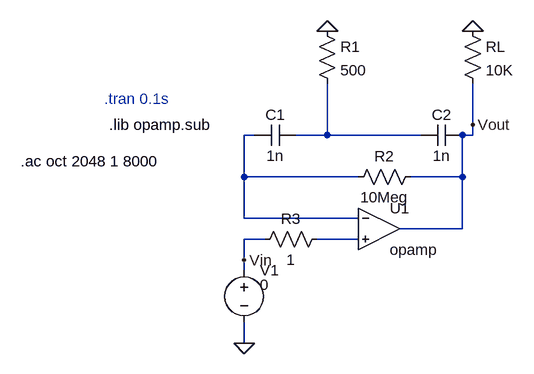
[diagram p0: schematic opamp_ideal.asc]
opamp_ideal.asc, the LTspice schematic file:
Version 4
SHEET 1 880 680
WIRE 544 272 544 208
WIRE 208 288 192 288
WIRE 320 288 320 208
WIRE 320 288 272 288
WIRE 464 288 320 288
WIRE 544 288 544 272
WIRE 544 288 528 288
WIRE 192 352 192 288
WIRE 368 352 192 352
WIRE 528 352 528 288
WIRE 528 352 448 352
WIRE 192 416 192 352
WIRE 368 416 192 416
WIRE 528 432 528 352
WIRE 528 432 432 432
WIRE 224 448 192 448
WIRE 368 448 304 448
WIRE 192 480 192 448
WIRE 192 496 192 480
WIRE 192 608 192 576
FLAG 192 608 0
FLAG 544 128 0
FLAG 320 128 0
FLAG 544 272 Vout
FLAG 192 480 Vin
SYMBOL /voltage 192 480 R0
WINDOW 3 24 38 Left 2
SYMATTR Value 0
SYMATTR InstName V1
SYMATTR Value2 AC 100m
SYMBOL /cap 528 272 R90
WINDOW 0 0 32 VBottom 2
WINDOW 3 32 32 VTop 2
SYMATTR InstName C2
SYMATTR Value 1n
SYMBOL /cap 272 272 R90
WINDOW 0 0 32 VBottom 2
WINDOW 3 32 32 VTop 2
SYMATTR InstName C1
SYMATTR Value 1n
SYMBOL /res 464 336 R90
WINDOW 0 0 56 VBottom 2
WINDOW 3 32 56 VTop 2
SYMATTR InstName R2
SYMATTR Value 10Meg
SYMBOL /res 304 112 R0
SYMATTR InstName R1
SYMATTR Value 500
SYMBOL /res 528 112 R0
SYMATTR InstName RL
SYMATTR Value 10K
SYMBOL opamp 400 368 R0
SYMATTR InstName U1
SYMATTR SpiceLine Aol=1000000K
SYMATTR SpiceLine2 GBW=10000Meg
SYMBOL res 320 432 R90
WINDOW 0 0 56 VBottom 2
WINDOW 3 32 56 VTop 2
SYMATTR InstName R3
SYMATTR Value 1
TEXT -24 232 Left 2 ;.tran 0.1s
TEXT -16 272 Left 2 !.lib opamp.sub
TEXT -152 328 Left 2 !.ac oct 2048 1 8000

The netlist it stands for:
* opamp_ideal.asc
V1 Vin 0 0 AC 100m
C2 Vout N002 1n
C1 N002 N001 1n
R2 Vout N001 10Meg
R1 0 N002 500
RL 0 Vout 10K
XU1 N001 N003 Vout opamp Aol=1000000K GBW=10000Meg  ; pins invin noninvin out
R3 N003 Vin 1
* .tran 0.1s
.lib opamp.sub
.ac oct 2048 1 8000
.backanno
.end